# Altium project GEM_AFE_128.PrjPcb (part 4 of 4)
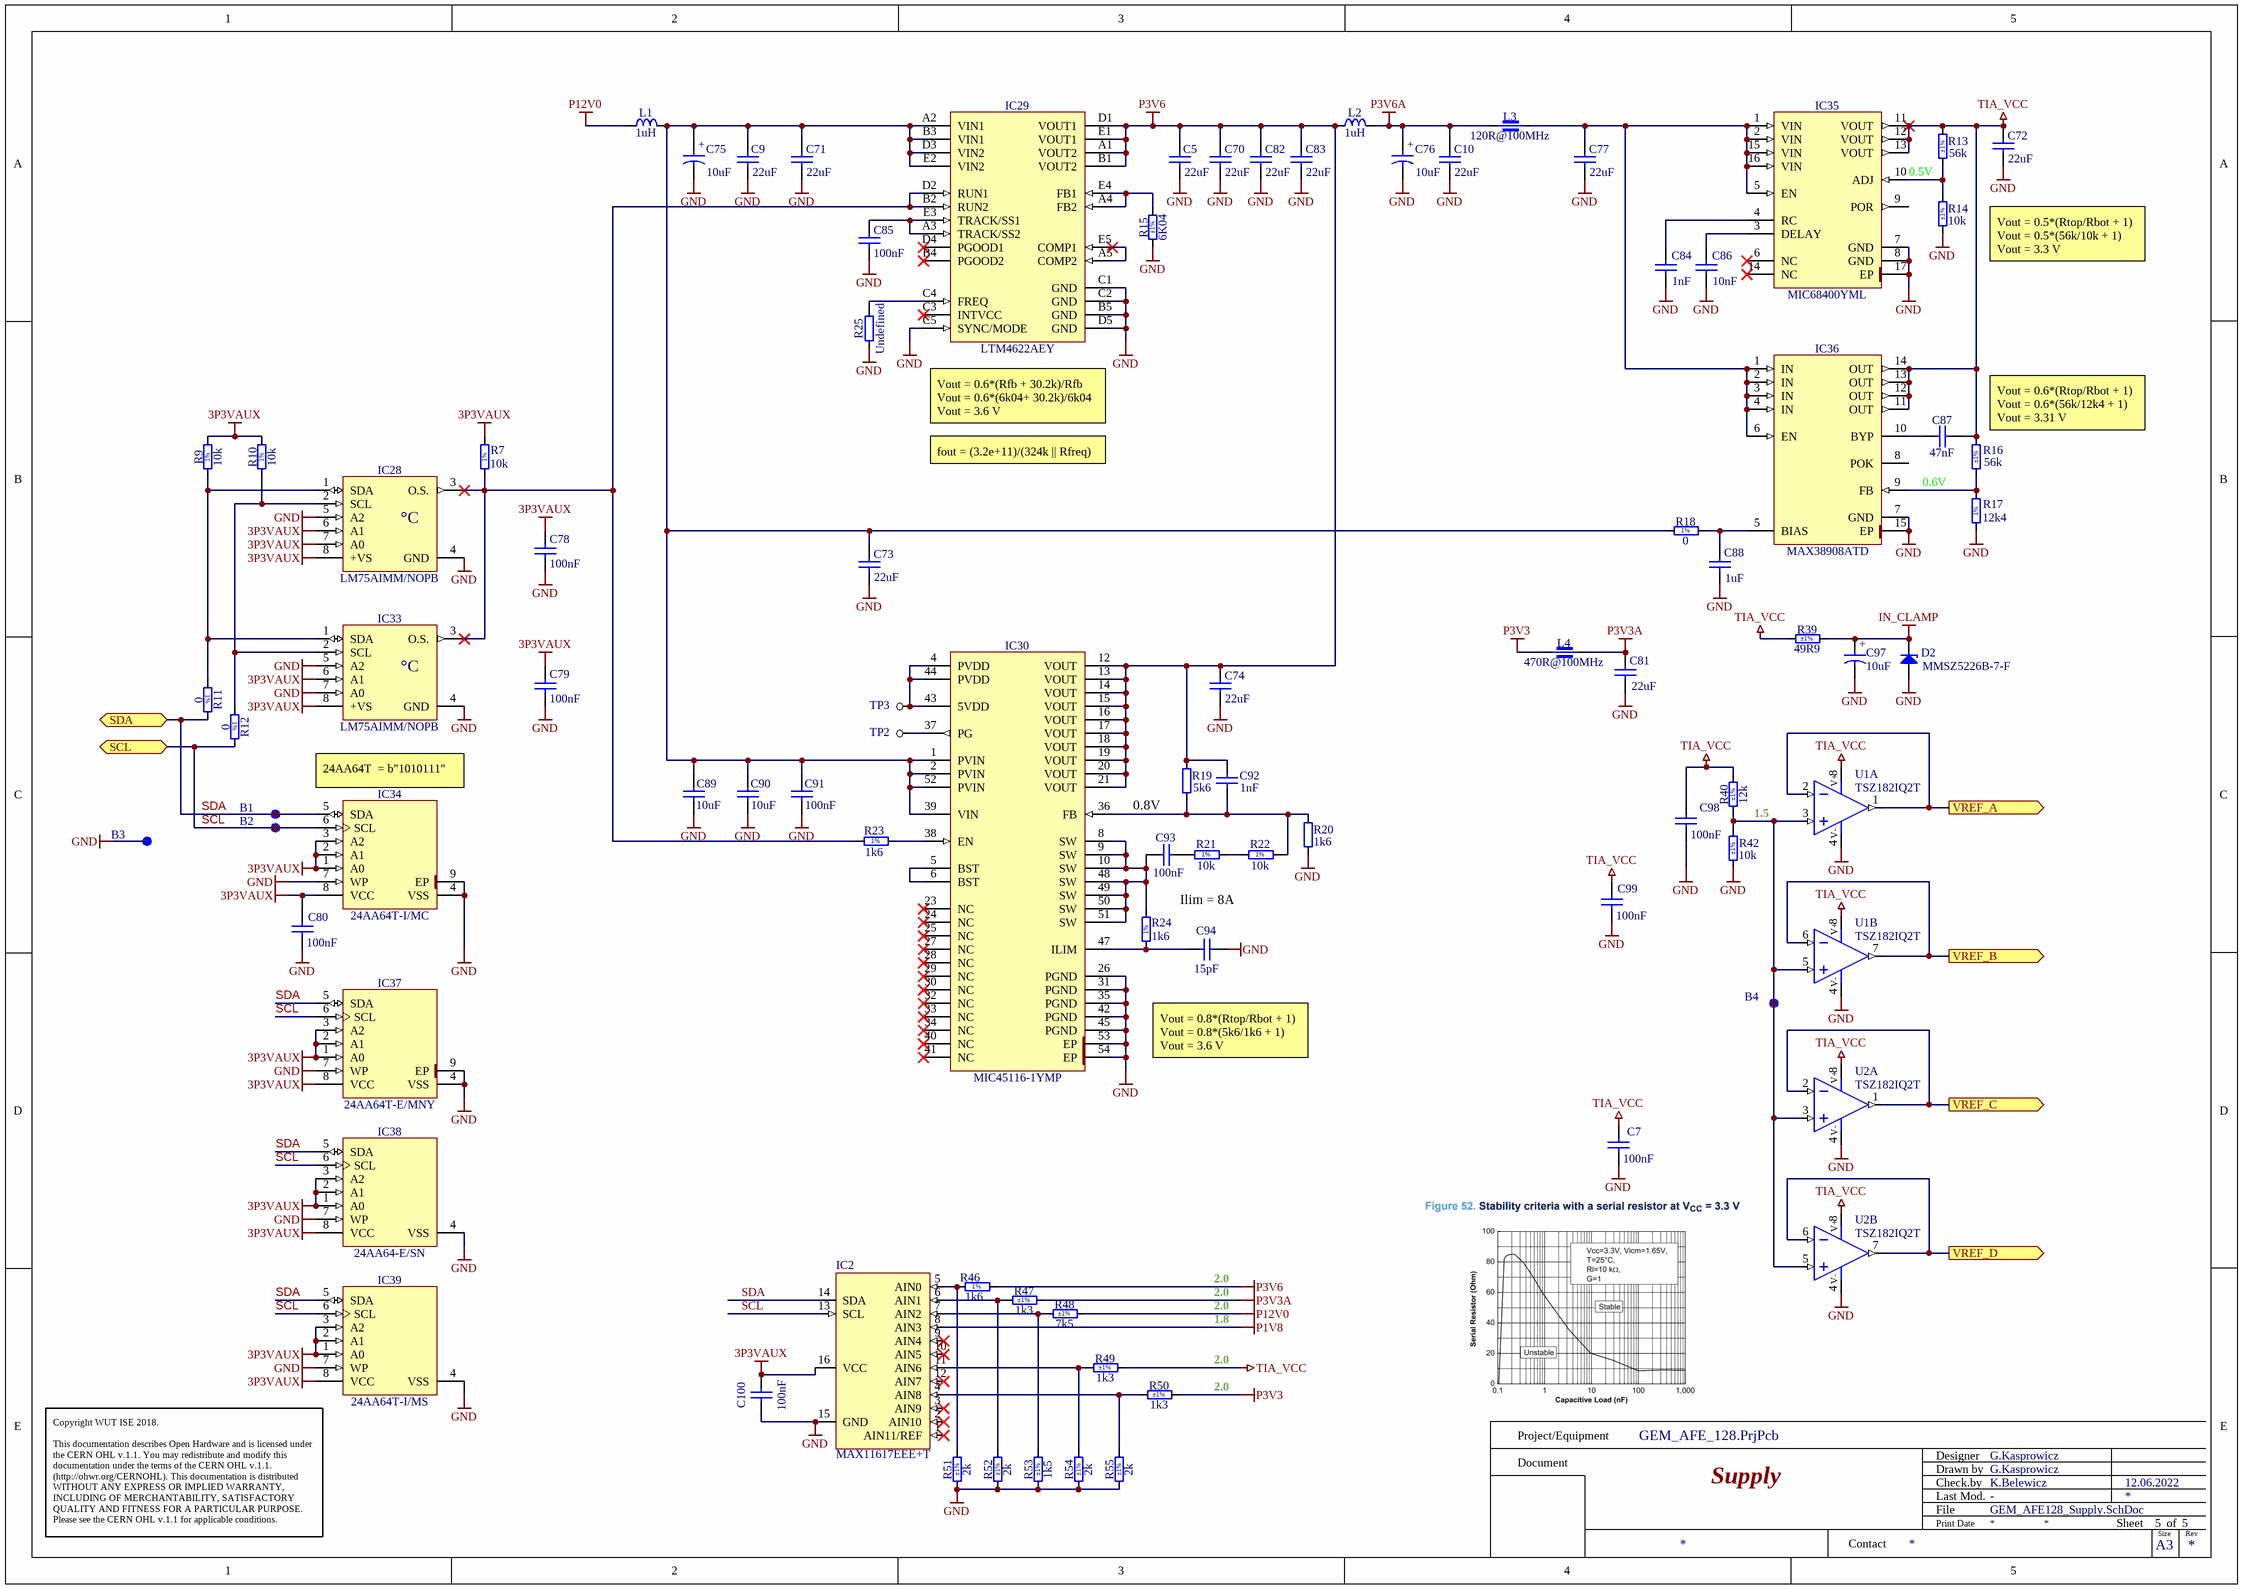
[diagram p5: GEM_AFE128_Supply.SchDoc]

## Nets that join several sheets
3P3VAUX: GEM_AFE_128 (J2.41), GEM_AFE128_Supply (29 pins)
GND: GEM_AFE_128 (102 pins), U_FE_channel0 (9 pins), U_FE_channel1 (9 pins), U_FE_channel2 (9 pins), U_FE_channel3 (9 pins), U_FE_channel4 (9 pins), U_FE_channel5 (9 pins), U_FE_channel6 (9 pins), U_FE_channel7 (9 pins), U_FE_channel8 (9 pins), U_FE_channel9 (9 pins), U_FE_channel10 (9 pins), U_FE_channel11 (9 pins), U_FE_channel12 (9 pins), U_FE_channel13 (9 pins), U_FE_channel14 (9 pins), U_FE_channel15 (9 pins), U_FE_channel16 (9 pins), U_FE_channel17 (9 pins), U_FE_channel18 (9 pins), U_FE_channel19 (9 pins), U_FE_channel20 (9 pins), U_FE_channel21 (9 pins), U_FE_channel22 (9 pins), U_FE_channel23 (9 pins), U_FE_channel24 (9 pins), U_FE_channel25 (9 pins), U_FE_channel26 (9 pins), U_FE_channel27 (9 pins), U_FE_channel28 (9 pins), U_FE_channel29 (9 pins), U_FE_channel30 (9 pins), U_FE_channel31 (9 pins), U_FE_channel32 (9 pins), U_FE_channel33 (9 pins), U_FE_channel34 (9 pins), U_FE_channel35 (9 pins), U_FE_channel36 (9 pins), U_FE_channel37 (9 pins), U_FE_channel38 (9 pins), U_FE_channel39 (9 pins), U_FE_channel40 (9 pins), U_FE_channel41 (9 pins), U_FE_channel42 (9 pins), U_FE_channel43 (9 pins), U_FE_channel44 (9 pins), U_FE_channel45 (9 pins), U_FE_channel46 (9 pins), U_FE_channel47 (9 pins), U_FE_channel48 (9 pins), U_FE_channel49 (9 pins), U_FE_channel50 (9 pins), U_FE_channel51 (9 pins), U_FE_channel52 (9 pins), U_FE_channel53 (9 pins), U_FE_channel54 (9 pins), U_FE_channel55 (9 pins), U_FE_channel56 (9 pins), U_FE_channel57 (9 pins), U_FE_channel58 (9 pins), U_FE_channel59 (9 pins), U_FE_channel60 (9 pins), U_FE_channel61 (9 pins), U_FE_channel62 (9 pins), U_FE_channel63 (9 pins), U_FE_channel64 (9 pins), U_FE_channel65 (9 pins), U_FE_channel66 (9 pins), U_FE_channel67 (9 pins), U_FE_channel68 (9 pins), U_FE_channel69 (9 pins), U_FE_channel70 (9 pins), U_FE_channel71 (9 pins), U_FE_channel72 (9 pins), U_FE_channel73 (9 pins), U_FE_channel74 (9 pins), U_FE_channel75 (9 pins), U_FE_channel76 (9 pins), U_FE_channel77 (9 pins), U_FE_channel78 (9 pins), U_FE_channel79 (9 pins), U_FE_channel80 (9 pins), U_FE_channel81 (9 pins), U_FE_channel82 (9 pins), U_FE_channel83 (9 pins), U_FE_channel84 (9 pins), U_FE_channel85 (9 pins), U_FE_channel86 (9 pins), U_FE_channel87 (9 pins), U_FE_channel88 (9 pins), U_FE_channel89 (9 pins), U_FE_channel90 (9 pins), U_FE_channel91 (9 pins), U_FE_channel92 (9 pins), U_FE_channel93 (9 pins), U_FE_channel94 (9 pins), U_FE_channel95 (9 pins), U_FE_channel96 (9 pins), U_FE_channel97 (9 pins), U_FE_channel98 (9 pins), U_FE_channel99 (9 pins), U_FE_channel100 (9 pins), U_FE_channel101 (9 pins), U_FE_channel102 (9 pins), U_FE_channel103 (9 pins), U_FE_channel104 (9 pins), U_FE_channel105 (9 pins), U_FE_channel106 (9 pins), U_FE_channel107 (9 pins), U_FE_channel108 (9 pins), U_FE_channel109 (9 pins), U_FE_channel110 (9 pins), U_FE_channel111 (9 pins), U_FE_channel112 (9 pins), U_FE_channel113 (9 pins), U_FE_channel114 (9 pins), U_FE_channel115 (9 pins), U_FE_channel116 (9 pins), U_FE_channel117 (9 pins), U_FE_channel118 (9 pins), U_FE_channel119 (9 pins), U_FE_channel120 (9 pins), U_FE_channel121 (9 pins), U_FE_channel122 (9 pins), U_FE_channel123 (9 pins), U_FE_channel124 (9 pins), U_FE_channel125 (9 pins), U_FE_channel126 (9 pins), U_FE_channel127 (9 pins), DAC (75 pins), CAL_logics (50 pins), GEM_AFE128_Supply (78 pins)
IN_CLAMP: U_FE_channel0 (C3A.2 D1A.5), U_FE_channel1 (C3B.2 D1B.5), U_FE_channel2 (C3C.2 D1C.5), U_FE_channel3 (C3D.2 D1D.5), U_FE_channel4 (C3E.2 D1E.5), U_FE_channel5 (C3F.2 D1F.5), U_FE_channel6 (C3G.2 D1G.5), U_FE_channel7 (C3H.2 D1H.5), U_FE_channel8 (C3I.2 D1I.5), U_FE_channel9 (C3J.2 D1J.5), U_FE_channel10 (C3K.2 D1K.5), U_FE_channel11 (C3L.2 D1L.5), U_FE_channel12 (C3M.2 D1M.5), U_FE_channel13 (C3N.2 D1N.5), U_FE_channel14 (C3O.2 D1O.5), U_FE_channel15 (C3P.2 D1P.5), U_FE_channel16 (C3Q.2 D1Q.5), U_FE_channel17 (C3R.2 D1R.5), U_FE_channel18 (C3S.2 D1S.5), U_FE_channel19 (C3T.2 D1T.5), U_FE_channel20 (C3U.2 D1U.5), U_FE_channel21 (C3V.2 D1V.5), U_FE_channel22 (C3W.2 D1W.5), U_FE_channel23 (C3X.2 D1X.5), U_FE_channel24 (C3Y.2 D1Y.5), U_FE_channel25 (C3Z.2 D1Z.5), U_FE_channel26 (C327.2 D127.5), U_FE_channel27 (C328.2 D128.5), U_FE_channel28 (C329.2 D129.5), U_FE_channel29 (C330.2 D130.5), U_FE_channel30 (C331.2 D131.5), U_FE_channel31 (C332.2 D132.5), U_FE_channel32 (C333.2 D133.5), U_FE_channel33 (C334.2 D134.5), U_FE_channel34 (C335.2 D135.5), U_FE_channel35 (C336.2 D136.5), U_FE_channel36 (C337.2 D137.5), U_FE_channel37 (C338.2 D138.5), U_FE_channel38 (C339.2 D139.5), U_FE_channel39 (C340.2 D140.5), U_FE_channel40 (C341.2 D141.5), U_FE_channel41 (C342.2 D142.5), U_FE_channel42 (C343.2 D143.5), U_FE_channel43 (C344.2 D144.5), U_FE_channel44 (C345.2 D145.5), U_FE_channel45 (C346.2 D146.5), U_FE_channel46 (C347.2 D147.5), U_FE_channel47 (C348.2 D148.5), U_FE_channel48 (C349.2 D149.5), U_FE_channel49 (C350.2 D150.5), U_FE_channel50 (C351.2 D151.5), U_FE_channel51 (C352.2 D152.5), U_FE_channel52 (C353.2 D153.5), U_FE_channel53 (C354.2 D154.5), U_FE_channel54 (C355.2 D155.5), U_FE_channel55 (C356.2 D156.5), U_FE_channel56 (C357.2 D157.5), U_FE_channel57 (C358.2 D158.5), U_FE_channel58 (C359.2 D159.5), U_FE_channel59 (C360.2 D160.5), U_FE_channel60 (C361.2 D161.5), U_FE_channel61 (C362.2 D162.5), U_FE_channel62 (C363.2 D163.5), U_FE_channel63 (C364.2 D164.5), U_FE_channel64 (C365.2 D165.5), U_FE_channel65 (C366.2 D166.5), U_FE_channel66 (C367.2 D167.5), U_FE_channel67 (C368.2 D168.5), U_FE_channel68 (C369.2 D169.5), U_FE_channel69 (C370.2 D170.5), U_FE_channel70 (C371.2 D171.5), U_FE_channel71 (C372.2 D172.5), U_FE_channel72 (C373.2 D173.5), U_FE_channel73 (C374.2 D174.5), U_FE_channel74 (C375.2 D175.5), U_FE_channel75 (C376.2 D176.5), U_FE_channel76 (C377.2 D177.5), U_FE_channel77 (C378.2 D178.5), U_FE_channel78 (C379.2 D179.5), U_FE_channel79 (C380.2 D180.5), U_FE_channel80 (C381.2 D181.5), U_FE_channel81 (C382.2 D182.5), U_FE_channel82 (C383.2 D183.5), U_FE_channel83 (C384.2 D184.5), U_FE_channel84 (C385.2 D185.5), U_FE_channel85 (C386.2 D186.5), U_FE_channel86 (C387.2 D187.5), U_FE_channel87 (C388.2 D188.5), U_FE_channel88 (C389.2 D189.5), U_FE_channel89 (C390.2 D190.5), U_FE_channel90 (C391.2 D191.5), U_FE_channel91 (C392.2 D192.5), U_FE_channel92 (C393.2 D193.5), U_FE_channel93 (C394.2 D194.5), U_FE_channel94 (C395.2 D195.5), U_FE_channel95 (C396.2 D196.5), U_FE_channel96 (C397.2 D197.5), U_FE_channel97 (C398.2 D198.5), U_FE_channel98 (C399.2 D199.5), U_FE_channel99 (C3100.2 D1100.5), U_FE_channel100 (C3101.2 D1101.5), U_FE_channel101 (C3102.2 D1102.5), U_FE_channel102 (C3103.2 D1103.5), U_FE_channel103 (C3104.2 D1104.5), U_FE_channel104 (C3105.2 D1105.5), U_FE_channel105 (C3106.2 D1106.5), U_FE_channel106 (C3107.2 D1107.5), U_FE_channel107 (C3108.2 D1108.5), U_FE_channel108 (C3109.2 D1109.5), U_FE_channel109 (C3110.2 D1110.5), U_FE_channel110 (C3111.2 D1111.5), U_FE_channel111 (C3112.2 D1112.5), U_FE_channel112 (C3113.2 D1113.5), U_FE_channel113 (C3114.2 D1114.5), U_FE_channel114 (C3115.2 D1115.5), U_FE_channel115 (C3116.2 D1116.5), U_FE_channel116 (C3117.2 D1117.5), U_FE_channel117 (C3118.2 D1118.5), U_FE_channel118 (C3119.2 D1119.5), U_FE_channel119 (C3120.2 D1120.5), U_FE_channel120 (C3121.2 D1121.5), U_FE_channel121 (C3122.2 D1122.5), U_FE_channel122 (C3123.2 D1123.5), U_FE_channel123 (C3124.2 D1124.5), U_FE_channel124 (C3125.2 D1125.5), U_FE_channel125 (C3126.2 D1126.5), U_FE_channel126 (C3127.2 D1127.5), U_FE_channel127 (C3128.2 D1128.5), GEM_AFE128_Supply (C97.1 D2.1 R39.2)
P1V8: GEM_AFE_128 (7 pins), DAC (27 pins), GEM_AFE128_Supply (IC2.8)
P3V3: GEM_AFE_128 (17 pins), GEM_AFE128_Supply (L4.1 R50.2)
P3V3A: DAC (24 pins), CAL_logics (50 pins), GEM_AFE128_Supply (C81.2 L4.2 R47.2)
P12V0: GEM_AFE_128 (5 pins), GEM_AFE128_Supply (L1.1 R48.2)
TIA_VCC: GEM_AFE_128 (LD3.2), U_FE_channel0 (C6A.2 IC1A.7 IC1A.8), U_FE_channel1 (C6B.2 IC1B.7 IC1B.8), U_FE_channel2 (C6C.2 IC1C.7 IC1C.8), U_FE_channel3 (C6D.2 IC1D.7 IC1D.8), U_FE_channel4 (C6E.2 IC1E.7 IC1E.8), U_FE_channel5 (C6F.2 IC1F.7 IC1F.8), U_FE_channel6 (C6G.2 IC1G.7 IC1G.8), U_FE_channel7 (C6H.2 IC1H.7 IC1H.8), U_FE_channel8 (C6I.2 IC1I.7 IC1I.8), U_FE_channel9 (C6J.2 IC1J.7 IC1J.8), U_FE_channel10 (C6K.2 IC1K.7 IC1K.8), U_FE_channel11 (C6L.2 IC1L.7 IC1L.8), U_FE_channel12 (C6M.2 IC1M.7 IC1M.8), U_FE_channel13 (C6N.2 IC1N.7 IC1N.8), U_FE_channel14 (C6O.2 IC1O.7 IC1O.8), U_FE_channel15 (C6P.2 IC1P.7 IC1P.8), U_FE_channel16 (C6Q.2 IC1Q.7 IC1Q.8), U_FE_channel17 (C6R.2 IC1R.7 IC1R.8), U_FE_channel18 (C6S.2 IC1S.7 IC1S.8), U_FE_channel19 (C6T.2 IC1T.7 IC1T.8), U_FE_channel20 (C6U.2 IC1U.7 IC1U.8), U_FE_channel21 (C6V.2 IC1V.7 IC1V.8), U_FE_channel22 (C6W.2 IC1W.7 IC1W.8), U_FE_channel23 (C6X.2 IC1X.7 IC1X.8), U_FE_channel24 (C6Y.2 IC1Y.7 IC1Y.8), U_FE_channel25 (C6Z.2 IC1Z.7 IC1Z.8), U_FE_channel26 (C627.2 IC127.7 IC127.8), U_FE_channel27 (C628.2 IC128.7 IC128.8), U_FE_channel28 (C629.2 IC129.7 IC129.8), U_FE_channel29 (C630.2 IC130.7 IC130.8), U_FE_channel30 (C631.2 IC131.7 IC131.8), U_FE_channel31 (C632.2 IC132.7 IC132.8), U_FE_channel32 (C633.2 IC133.7 IC133.8), U_FE_channel33 (C634.2 IC134.7 IC134.8), U_FE_channel34 (C635.2 IC135.7 IC135.8), U_FE_channel35 (C636.2 IC136.7 IC136.8), U_FE_channel36 (C637.2 IC137.7 IC137.8), U_FE_channel37 (C638.2 IC138.7 IC138.8), U_FE_channel38 (C639.2 IC139.7 IC139.8), U_FE_channel39 (C640.2 IC140.7 IC140.8), U_FE_channel40 (C641.2 IC141.7 IC141.8), U_FE_channel41 (C642.2 IC142.7 IC142.8), U_FE_channel42 (C643.2 IC143.7 IC143.8), U_FE_channel43 (C644.2 IC144.7 IC144.8), U_FE_channel44 (C645.2 IC145.7 IC145.8), U_FE_channel45 (C646.2 IC146.7 IC146.8), U_FE_channel46 (C647.2 IC147.7 IC147.8), U_FE_channel47 (C648.2 IC148.7 IC148.8), U_FE_channel48 (C649.2 IC149.7 IC149.8), U_FE_channel49 (C650.2 IC150.7 IC150.8), U_FE_channel50 (C651.2 IC151.7 IC151.8), U_FE_channel51 (C652.2 IC152.7 IC152.8), U_FE_channel52 (C653.2 IC153.7 IC153.8), U_FE_channel53 (C654.2 IC154.7 IC154.8), U_FE_channel54 (C655.2 IC155.7 IC155.8), U_FE_channel55 (C656.2 IC156.7 IC156.8), U_FE_channel56 (C657.2 IC157.7 IC157.8), U_FE_channel57 (C658.2 IC158.7 IC158.8), U_FE_channel58 (C659.2 IC159.7 IC159.8), U_FE_channel59 (C660.2 IC160.7 IC160.8), U_FE_channel60 (C661.2 IC161.7 IC161.8), U_FE_channel61 (C662.2 IC162.7 IC162.8), U_FE_channel62 (C663.2 IC163.7 IC163.8), U_FE_channel63 (C664.2 IC164.7 IC164.8), U_FE_channel64 (C665.2 IC165.7 IC165.8), U_FE_channel65 (C666.2 IC166.7 IC166.8), U_FE_channel66 (C667.2 IC167.7 IC167.8), U_FE_channel67 (C668.2 IC168.7 IC168.8), U_FE_channel68 (C669.2 IC169.7 IC169.8), U_FE_channel69 (C670.2 IC170.7 IC170.8), U_FE_channel70 (C671.2 IC171.7 IC171.8), U_FE_channel71 (C672.2 IC172.7 IC172.8), U_FE_channel72 (C673.2 IC173.7 IC173.8), U_FE_channel73 (C674.2 IC174.7 IC174.8), U_FE_channel74 (C675.2 IC175.7 IC175.8), U_FE_channel75 (C676.2 IC176.7 IC176.8), U_FE_channel76 (C677.2 IC177.7 IC177.8), U_FE_channel77 (C678.2 IC178.7 IC178.8), U_FE_channel78 (C679.2 IC179.7 IC179.8), U_FE_channel79 (C680.2 IC180.7 IC180.8), U_FE_channel80 (C681.2 IC181.7 IC181.8), U_FE_channel81 (C682.2 IC182.7 IC182.8), U_FE_channel82 (C683.2 IC183.7 IC183.8), U_FE_channel83 (C684.2 IC184.7 IC184.8), U_FE_channel84 (C685.2 IC185.7 IC185.8), U_FE_channel85 (C686.2 IC186.7 IC186.8), U_FE_channel86 (C687.2 IC187.7 IC187.8), U_FE_channel87 (C688.2 IC188.7 IC188.8), U_FE_channel88 (C689.2 IC189.7 IC189.8), U_FE_channel89 (C690.2 IC190.7 IC190.8), U_FE_channel90 (C691.2 IC191.7 IC191.8), U_FE_channel91 (C692.2 IC192.7 IC192.8), U_FE_channel92 (C693.2 IC193.7 IC193.8), U_FE_channel93 (C694.2 IC194.7 IC194.8), U_FE_channel94 (C695.2 IC195.7 IC195.8), U_FE_channel95 (C696.2 IC196.7 IC196.8), U_FE_channel96 (C697.2 IC197.7 IC197.8), U_FE_channel97 (C698.2 IC198.7 IC198.8), U_FE_channel98 (C699.2 IC199.7 IC199.8), U_FE_channel99 (C6100.2 IC1100.7 IC1100.8), U_FE_channel100 (C6101.2 IC1101.7 IC1101.8), U_FE_channel101 (C6102.2 IC1102.7 IC1102.8), U_FE_channel102 (C6103.2 IC1103.7 IC1103.8), U_FE_channel103 (C6104.2 IC1104.7 IC1104.8), U_FE_channel104 (C6105.2 IC1105.7 IC1105.8), U_FE_channel105 (C6106.2 IC1106.7 IC1106.8), U_FE_channel106 (C6107.2 IC1107.7 IC1107.8), U_FE_channel107 (C6108.2 IC1108.7 IC1108.8), U_FE_channel108 (C6109.2 IC1109.7 IC1109.8), U_FE_channel109 (C6110.2 IC1110.7 IC1110.8), U_FE_channel110 (C6111.2 IC1111.7 IC1111.8), U_FE_channel111 (C6112.2 IC1112.7 IC1112.8), U_FE_channel112 (C6113.2 IC1113.7 IC1113.8), U_FE_channel113 (C6114.2 IC1114.7 IC1114.8), U_FE_channel114 (C6115.2 IC1115.7 IC1115.8), U_FE_channel115 (C6116.2 IC1116.7 IC1116.8), U_FE_channel116 (C6117.2 IC1117.7 IC1117.8), U_FE_channel117 (C6118.2 IC1118.7 IC1118.8), U_FE_channel118 (C6119.2 IC1119.7 IC1119.8), U_FE_channel119 (C6120.2 IC1120.7 IC1120.8), U_FE_channel120 (C6121.2 IC1121.7 IC1121.8), U_FE_channel121 (C6122.2 IC1122.7 IC1122.8), U_FE_channel122 (C6123.2 IC1123.7 IC1123.8), U_FE_channel123 (C6124.2 IC1124.7 IC1124.8), U_FE_channel124 (C6125.2 IC1125.7 IC1125.8), U_FE_channel125 (C6126.2 IC1126.7 IC1126.8), U_FE_channel126 (C6127.2 IC1127.7 IC1127.8), U_FE_channel127 (C6128.2 IC1128.7 IC1128.8), GEM_AFE128_Supply (19 pins)
CAL_IN0: U_FE_channel0 (C1A.2 R1A.2), CAL_logics (IC13.15)
CAL_IN1: U_FE_channel1 (C1B.2 R1B.2), CAL_logics (IC13.1)
CAL_IN2: U_FE_channel2 (C1C.2 R1C.2), CAL_logics (IC13.2)
CAL_IN3: U_FE_channel3 (C1D.2 R1D.2), CAL_logics (IC13.3)
CAL_IN4: U_FE_channel4 (C1E.2 R1E.2), CAL_logics (IC13.4)
CAL_IN5: U_FE_channel5 (C1F.2 R1F.2), CAL_logics (IC13.5)
CAL_IN6: U_FE_channel6 (C1G.2 R1G.2), CAL_logics (IC13.6)
CAL_IN7: U_FE_channel7 (C1H.2 R1H.2), CAL_logics (IC13.7)
CAL_IN8: U_FE_channel8 (C1I.2 R1I.2), CAL_logics (IC15.15)
CAL_IN9: U_FE_channel9 (C1J.2 R1J.2), CAL_logics (IC15.1)
CAL_IN10: U_FE_channel10 (C1K.2 R1K.2), CAL_logics (IC15.2)
CAL_IN11: U_FE_channel11 (C1L.2 R1L.2), CAL_logics (IC15.3)
CAL_IN12: U_FE_channel12 (C1M.2 R1M.2), CAL_logics (IC15.4)
CAL_IN13: U_FE_channel13 (C1N.2 R1N.2), CAL_logics (IC15.5)
CAL_IN14: U_FE_channel14 (C1O.2 R1O.2), CAL_logics (IC15.6)
CAL_IN15: U_FE_channel15 (C1P.2 R1P.2), CAL_logics (IC15.7)
CAL_IN16: U_FE_channel16 (C1Q.2 R1Q.2), CAL_logics (IC17.15)
CAL_IN17: U_FE_channel17 (C1R.2 R1R.2), CAL_logics (IC17.1)
CAL_IN18: U_FE_channel18 (C1S.2 R1S.2), CAL_logics (IC17.2)
CAL_IN19: U_FE_channel19 (C1T.2 R1T.2), CAL_logics (IC17.3)
CAL_IN20: U_FE_channel20 (C1U.2 R1U.2), CAL_logics (IC17.4)
CAL_IN21: U_FE_channel21 (C1V.2 R1V.2), CAL_logics (IC17.5)
CAL_IN22: U_FE_channel22 (C1W.2 R1W.2), CAL_logics (IC17.6)
CAL_IN23: U_FE_channel23 (C1X.2 R1X.2), CAL_logics (IC17.7)
CAL_IN24: U_FE_channel24 (C1Y.2 R1Y.2), CAL_logics (IC19.15)
CAL_IN25: U_FE_channel25 (C1Z.2 R1Z.2), CAL_logics (IC19.1)
CAL_IN26: U_FE_channel26 (C127.2 R127.2), CAL_logics (IC19.2)
CAL_IN27: U_FE_channel27 (C128.2 R128.2), CAL_logics (IC19.3)
CAL_IN28: U_FE_channel28 (C129.2 R129.2), CAL_logics (IC19.4)
CAL_IN29: U_FE_channel29 (C130.2 R130.2), CAL_logics (IC19.5)
CAL_IN30: U_FE_channel30 (C131.2 R131.2), CAL_logics (IC19.6)
CAL_IN31: U_FE_channel31 (C132.2 R132.2), CAL_logics (IC19.7)
CAL_IN32: U_FE_channel32 (C133.2 R133.2), CAL_logics (IC21.15)
CAL_IN33: U_FE_channel33 (C134.2 R134.2), CAL_logics (IC21.1)
CAL_IN34: U_FE_channel34 (C135.2 R135.2), CAL_logics (IC21.2)
CAL_IN35: U_FE_channel35 (C136.2 R136.2), CAL_logics (IC21.3)
CAL_IN36: U_FE_channel36 (C137.2 R137.2), CAL_logics (IC21.4)
CAL_IN37: U_FE_channel37 (C138.2 R138.2), CAL_logics (IC21.5)
CAL_IN38: U_FE_channel38 (C139.2 R139.2), CAL_logics (IC21.6)
CAL_IN39: U_FE_channel39 (C140.2 R140.2), CAL_logics (IC21.7)
CAL_IN40: U_FE_channel40 (C141.2 R141.2), CAL_logics (IC23.15)
CAL_IN41: U_FE_channel41 (C142.2 R142.2), CAL_logics (IC23.1)
CAL_IN42: U_FE_channel42 (C143.2 R143.2), CAL_logics (IC23.2)
CAL_IN43: U_FE_channel43 (C144.2 R144.2), CAL_logics (IC23.3)
CAL_IN44: U_FE_channel44 (C145.2 R145.2), CAL_logics (IC23.4)
CAL_IN45: U_FE_channel45 (C146.2 R146.2), CAL_logics (IC23.5)
CAL_IN46: U_FE_channel46 (C147.2 R147.2), CAL_logics (IC23.6)
CAL_IN47: U_FE_channel47 (C148.2 R148.2), CAL_logics (IC23.7)
CAL_IN48: U_FE_channel48 (C149.2 R149.2), CAL_logics (IC25.15)
CAL_IN49: U_FE_channel49 (C150.2 R150.2), CAL_logics (IC25.1)
CAL_IN50: U_FE_channel50 (C151.2 R151.2), CAL_logics (IC25.2)
CAL_IN51: U_FE_channel51 (C152.2 R152.2), CAL_logics (IC25.3)
CAL_IN52: U_FE_channel52 (C153.2 R153.2), CAL_logics (IC25.4)
CAL_IN53: U_FE_channel53 (C154.2 R154.2), CAL_logics (IC25.5)
CAL_IN54: U_FE_channel54 (C155.2 R155.2), CAL_logics (IC25.6)
CAL_IN55: U_FE_channel55 (C156.2 R156.2), CAL_logics (IC25.7)
CAL_IN56: U_FE_channel56 (C157.2 R157.2), CAL_logics (IC27.15)
CAL_IN57: U_FE_channel57 (C158.2 R158.2), CAL_logics (IC27.1)
CAL_IN58: U_FE_channel58 (C159.2 R159.2), CAL_logics (IC27.2)
CAL_IN59: U_FE_channel59 (C160.2 R160.2), CAL_logics (IC27.3)
CAL_IN60: U_FE_channel60 (C161.2 R161.2), CAL_logics (IC27.4)
CAL_IN61: U_FE_channel61 (C162.2 R162.2), CAL_logics (IC27.5)
CAL_IN62: U_FE_channel62 (C163.2 R163.2), CAL_logics (IC27.6)
CAL_IN63: U_FE_channel63 (C164.2 R164.2), CAL_logics (IC27.7)
CAL_IN64: U_FE_channel64 (C165.2 R165.2), CAL_logics (IC12.15)
CAL_IN65: U_FE_channel65 (C166.2 R166.2), CAL_logics (IC12.1)
CAL_IN66: U_FE_channel66 (C167.2 R167.2), CAL_logics (IC12.2)
CAL_IN67: U_FE_channel67 (C168.2 R168.2), CAL_logics (IC12.3)
CAL_IN68: U_FE_channel68 (C169.2 R169.2), CAL_logics (IC12.4)
CAL_IN69: U_FE_channel69 (C170.2 R170.2), CAL_logics (IC12.5)
CAL_IN70: U_FE_channel70 (C171.2 R171.2), CAL_logics (IC12.6)
CAL_IN71: U_FE_channel71 (C172.2 R172.2), CAL_logics (IC12.7)
CAL_IN72: U_FE_channel72 (C173.2 R173.2), CAL_logics (IC14.15)
CAL_IN73: U_FE_channel73 (C174.2 R174.2), CAL_logics (IC14.1)
CAL_IN74: U_FE_channel74 (C175.2 R175.2), CAL_logics (IC14.2)
CAL_IN75: U_FE_channel75 (C176.2 R176.2), CAL_logics (IC14.3)
CAL_IN76: U_FE_channel76 (C177.2 R177.2), CAL_logics (IC14.4)
CAL_IN77: U_FE_channel77 (C178.2 R178.2), CAL_logics (IC14.5)
CAL_IN78: U_FE_channel78 (C179.2 R179.2), CAL_logics (IC14.6)
CAL_IN79: U_FE_channel79 (C180.2 R180.2), CAL_logics (IC14.7)
CAL_IN80: U_FE_channel80 (C181.2 R181.2), CAL_logics (IC16.15)
CAL_IN81: U_FE_channel81 (C182.2 R182.2), CAL_logics (IC16.1)
CAL_IN82: U_FE_channel82 (C183.2 R183.2), CAL_logics (IC16.2)
CAL_IN83: U_FE_channel83 (C184.2 R184.2), CAL_logics (IC16.3)
CAL_IN84: U_FE_channel84 (C185.2 R185.2), CAL_logics (IC16.4)
CAL_IN85: U_FE_channel85 (C186.2 R186.2), CAL_logics (IC16.5)
CAL_IN86: U_FE_channel86 (C187.2 R187.2), CAL_logics (IC16.6)
CAL_IN87: U_FE_channel87 (C188.2 R188.2), CAL_logics (IC16.7)
CAL_IN88: U_FE_channel88 (C189.2 R189.2), CAL_logics (IC18.15)
CAL_IN89: U_FE_channel89 (C190.2 R190.2), CAL_logics (IC18.1)
CAL_IN90: U_FE_channel90 (C191.2 R191.2), CAL_logics (IC18.2)
CAL_IN91: U_FE_channel91 (C192.2 R192.2), CAL_logics (IC18.3)
CAL_IN92: U_FE_channel92 (C193.2 R193.2), CAL_logics (IC18.4)
CAL_IN93: U_FE_channel93 (C194.2 R194.2), CAL_logics (IC18.5)
CAL_IN94: U_FE_channel94 (C195.2 R195.2), CAL_logics (IC18.6)
CAL_IN95: U_FE_channel95 (C196.2 R196.2), CAL_logics (IC18.7)
CAL_IN96: U_FE_channel96 (C197.2 R197.2), CAL_logics (IC20.15)
CAL_IN97: U_FE_channel97 (C198.2 R198.2), CAL_logics (IC20.1)
CAL_IN98: U_FE_channel98 (C199.2 R199.2), CAL_logics (IC20.2)
CAL_IN99: U_FE_channel99 (C1100.2 R1100.2), CAL_logics (IC20.3)
CAL_IN100: U_FE_channel100 (C1101.2 R1101.2), CAL_logics (IC20.4)
CAL_IN101: U_FE_channel101 (C1102.2 R1102.2), CAL_logics (IC20.5)
CAL_IN102: U_FE_channel102 (C1103.2 R1103.2), CAL_logics (IC20.6)
CAL_IN103: U_FE_channel103 (C1104.2 R1104.2), CAL_logics (IC20.7)
CAL_IN104: U_FE_channel104 (C1105.2 R1105.2), CAL_logics (IC22.15)
CAL_IN105: U_FE_channel105 (C1106.2 R1106.2), CAL_logics (IC22.1)
CAL_IN106: U_FE_channel106 (C1107.2 R1107.2), CAL_logics (IC22.2)
CAL_IN107: U_FE_channel107 (C1108.2 R1108.2), CAL_logics (IC22.3)
CAL_IN108: U_FE_channel108 (C1109.2 R1109.2), CAL_logics (IC22.4)
CAL_IN109: U_FE_channel109 (C1110.2 R1110.2), CAL_logics (IC22.5)
CAL_IN110: U_FE_channel110 (C1111.2 R1111.2), CAL_logics (IC22.6)
CAL_IN111: U_FE_channel111 (C1112.2 R1112.2), CAL_logics (IC22.7)
CAL_IN112: U_FE_channel112 (C1113.2 R1113.2), CAL_logics (IC24.15)
CAL_IN113: U_FE_channel113 (C1114.2 R1114.2), CAL_logics (IC24.1)
CAL_IN114: U_FE_channel114 (C1115.2 R1115.2), CAL_logics (IC24.2)
CAL_IN115: U_FE_channel115 (C1116.2 R1116.2), CAL_logics (IC24.3)
CAL_IN116: U_FE_channel116 (C1117.2 R1117.2), CAL_logics (IC24.4)
CAL_IN117: U_FE_channel117 (C1118.2 R1118.2), CAL_logics (IC24.5)
CAL_IN118: U_FE_channel118 (C1119.2 R1119.2), CAL_logics (IC24.6)
CAL_IN119: U_FE_channel119 (C1120.2 R1120.2), CAL_logics (IC24.7)
CAL_IN120: U_FE_channel120 (C1121.2 R1121.2), CAL_logics (IC26.15)
CAL_IN121: U_FE_channel121 (C1122.2 R1122.2), CAL_logics (IC26.1)
CAL_IN122: U_FE_channel122 (C1123.2 R1123.2), CAL_logics (IC26.2)
CAL_IN123: U_FE_channel123 (C1124.2 R1124.2), CAL_logics (IC26.3)
CAL_IN124: U_FE_channel124 (C1125.2 R1125.2), CAL_logics (IC26.4)
CAL_IN125: U_FE_channel125 (C1126.2 R1126.2), CAL_logics (IC26.5)
CAL_IN126: U_FE_channel126 (C1127.2 R1127.2), CAL_logics (IC26.6)
CAL_IN127: U_FE_channel127 (C1128.2 R1128.2), CAL_logics (IC26.7)
CAL_SRCLK: GEM_AFE_128 (R30.2), CAL_logics (16 pins)
CAL_SRDAT: GEM_AFE_128 (R29.1), CAL_logics (IC13.14)
CAL_SRDAT_OUT: GEM_AFE_128 (R28.1), CAL_logics (R3.2)
CS_A0: GEM_AFE_128 (R32.1), DAC (IC9.1)
CS_A1: GEM_AFE_128 (R33.1), DAC (IC9.2)
CS_A2: GEM_AFE_128 (R38.2), DAC (IC9.3)
CSn: GEM_AFE_128 (R34.2), DAC (IC9.4)
DAC_LDACn: GEM_AFE_128 (R27.1), DAC (8 pins)
DAC_RESETn: GEM_AFE_128 (R31.2 R56.1), DAC (8 pins)
DAC_SCLK: GEM_AFE_128 (R37.2), DAC (8 pins)
DAC_SDI: GEM_AFE_128 (R36.1), DAC (8 pins)
DAC_SDO: GEM_AFE_128 (R35.1), DAC (8 pins)
IN_P0: GEM_AFE_128 (J1.81), U_FE_channel0 (D1A.3 R4A.1 R8A.1)
IN_P1: GEM_AFE_128 (J1.90), U_FE_channel1 (D1B.3 R4B.1 R8B.1)
IN_P2: GEM_AFE_128 (J1.80), U_FE_channel2 (D1C.3 R4C.1 R8C.1)
IN_P3: GEM_AFE_128 (J1.91), U_FE_channel3 (D1D.3 R4D.1 R8D.1)
IN_P4: GEM_AFE_128 (J1.79), U_FE_channel4 (D1E.3 R4E.1 R8E.1)
IN_P5: GEM_AFE_128 (J1.78), U_FE_channel5 (D1F.3 R4F.1 R8F.1)
IN_P6: GEM_AFE_128 (J1.93), U_FE_channel6 (D1G.3 R4G.1 R8G.1)
IN_P7: GEM_AFE_128 (J1.77), U_FE_channel7 (D1H.3 R4H.1 R8H.1)
IN_P8: GEM_AFE_128 (J1.94), U_FE_channel8 (D1I.3 R4I.1 R8I.1)
IN_P9: GEM_AFE_128 (J1.76), U_FE_channel9 (D1J.3 R4J.1 R8J.1)
IN_P10: GEM_AFE_128 (J1.75), U_FE_channel10 (D1K.3 R4K.1 R8K.1)
IN_P11: GEM_AFE_128 (J1.96), U_FE_channel11 (D1L.3 R4L.1 R8L.1)
IN_P12: GEM_AFE_128 (J1.74), U_FE_channel12 (D1M.3 R4M.1 R8M.1)
IN_P13: GEM_AFE_128 (J1.97), U_FE_channel13 (D1N.3 R4N.1 R8N.1)
IN_P14: GEM_AFE_128 (J1.73), U_FE_channel14 (D1O.3 R4O.1 R8O.1)
IN_P15: GEM_AFE_128 (J1.72), U_FE_channel15 (D1P.3 R4P.1 R8P.1)
IN_P16: GEM_AFE_128 (J1.99), U_FE_channel16 (D1Q.3 R4Q.1 R8Q.1)
IN_P17: GEM_AFE_128 (J1.71), U_FE_channel17 (D1R.3 R4R.1 R8R.1)
IN_P18: GEM_AFE_128 (J1.100), U_FE_channel18 (D1S.3 R4S.1 R8S.1)
IN_P19: GEM_AFE_128 (J1.70), U_FE_channel19 (D1T.3 R4T.1 R8T.1)
IN_P20: GEM_AFE_128 (J1.69), U_FE_channel20 (D1U.3 R4U.1 R8U.1)
IN_P21: GEM_AFE_128 (J1.102), U_FE_channel21 (D1V.3 R4V.1 R8V.1)
IN_P22: GEM_AFE_128 (J1.68), U_FE_channel22 (D1W.3 R4W.1 R8W.1)
IN_P23: GEM_AFE_128 (J1.103), U_FE_channel23 (D1X.3 R4X.1 R8X.1)
IN_P24: GEM_AFE_128 (J1.67), U_FE_channel24 (D1Y.3 R4Y.1 R8Y.1)
IN_P25: GEM_AFE_128 (J1.66), U_FE_channel25 (D1Z.3 R4Z.1 R8Z.1)
IN_P26: GEM_AFE_128 (J1.105), U_FE_channel26 (D127.3 R427.1 R827.1)
IN_P27: GEM_AFE_128 (J1.65), U_FE_channel27 (D128.3 R428.1 R828.1)
IN_P28: GEM_AFE_128 (J1.106), U_FE_channel28 (D129.3 R429.1 R829.1)
IN_P29: GEM_AFE_128 (J1.64), U_FE_channel29 (D130.3 R430.1 R830.1)
IN_P30: GEM_AFE_128 (J1.63), U_FE_channel30 (D131.3 R431.1 R831.1)
IN_P31: GEM_AFE_128 (J1.108), U_FE_channel31 (D132.3 R432.1 R832.1)
IN_P32: GEM_AFE_128 (J1.62), U_FE_channel32 (D133.3 R433.1 R833.1)
IN_P33: GEM_AFE_128 (J1.109), U_FE_channel33 (D134.3 R434.1 R834.1)
IN_P34: GEM_AFE_128 (J1.61), U_FE_channel34 (D135.3 R435.1 R835.1)
IN_P35: GEM_AFE_128 (J1.60), U_FE_channel35 (D136.3 R436.1 R836.1)
IN_P36: GEM_AFE_128 (J1.111), U_FE_channel36 (D137.3 R437.1 R837.1)
IN_P37: GEM_AFE_128 (J1.59), U_FE_channel37 (D138.3 R438.1 R838.1)
IN_P38: GEM_AFE_128 (J1.112), U_FE_channel38 (D139.3 R439.1 R839.1)
IN_P39: GEM_AFE_128 (J1.58), U_FE_channel39 (D140.3 R440.1 R840.1)
IN_P40: GEM_AFE_128 (J1.57), U_FE_channel40 (D141.3 R441.1 R841.1)
IN_P41: GEM_AFE_128 (J1.114), U_FE_channel41 (D142.3 R442.1 R842.1)
IN_P42: GEM_AFE_128 (J1.56), U_FE_channel42 (D143.3 R443.1 R843.1)
IN_P43: GEM_AFE_128 (J1.115), U_FE_channel43 (D144.3 R444.1 R844.1)
IN_P44: GEM_AFE_128 (J1.55), U_FE_channel44 (D145.3 R445.1 R845.1)
IN_P45: GEM_AFE_128 (J1.54), U_FE_channel45 (D146.3 R446.1 R846.1)
IN_P46: GEM_AFE_128 (J1.117), U_FE_channel46 (D147.3 R447.1 R847.1)
IN_P47: GEM_AFE_128 (J1.53), U_FE_channel47 (D148.3 R448.1 R848.1)
IN_P48: GEM_AFE_128 (J1.118), U_FE_channel48 (D149.3 R449.1 R849.1)
IN_P49: GEM_AFE_128 (J1.52), U_FE_channel49 (D150.3 R450.1 R850.1)
IN_P50: GEM_AFE_128 (J1.51), U_FE_channel50 (D151.3 R451.1 R851.1)
IN_P51: GEM_AFE_128 (J1.120), U_FE_channel51 (D152.3 R452.1 R852.1)
IN_P52: GEM_AFE_128 (J1.50), U_FE_channel52 (D153.3 R453.1 R853.1)
IN_P53: GEM_AFE_128 (J1.121), U_FE_channel53 (D154.3 R454.1 R854.1)
IN_P54: GEM_AFE_128 (J1.49), U_FE_channel54 (D155.3 R455.1 R855.1)
IN_P55: GEM_AFE_128 (J1.48), U_FE_channel55 (D156.3 R456.1 R856.1)
IN_P56: GEM_AFE_128 (J1.123), U_FE_channel56 (D157.3 R457.1 R857.1)
IN_P57: GEM_AFE_128 (J1.47), U_FE_channel57 (D158.3 R458.1 R858.1)
IN_P58: GEM_AFE_128 (J1.124), U_FE_channel58 (D159.3 R459.1 R859.1)
IN_P59: GEM_AFE_128 (J1.46), U_FE_channel59 (D160.3 R460.1 R860.1)
IN_P60: GEM_AFE_128 (J1.45), U_FE_channel60 (D161.3 R461.1 R861.1)
IN_P61: GEM_AFE_128 (J1.126), U_FE_channel61 (D162.3 R462.1 R862.1)
IN_P62: GEM_AFE_128 (J1.44), U_FE_channel62 (D163.3 R463.1 R863.1)
IN_P63: GEM_AFE_128 (J1.127), U_FE_channel63 (D164.3 R464.1 R864.1)
IN_P64: GEM_AFE_128 (J1.43), U_FE_channel64 (D165.3 R465.1 R865.1)
IN_P65: GEM_AFE_128 (J1.42), U_FE_channel65 (D166.3 R466.1 R866.1)
IN_P66: GEM_AFE_128 (J1.129), U_FE_channel66 (D167.3 R467.1 R867.1)
IN_P67: GEM_AFE_128 (J1.41), U_FE_channel67 (D168.3 R468.1 R868.1)
IN_P68: GEM_AFE_128 (J1.130), U_FE_channel68 (D169.3 R469.1 R869.1)
IN_P69: GEM_AFE_128 (J1.40), U_FE_channel69 (D170.3 R470.1 R870.1)
IN_P70: GEM_AFE_128 (J1.39), U_FE_channel70 (D171.3 R471.1 R871.1)
IN_P71: GEM_AFE_128 (J1.132), U_FE_channel71 (D172.3 R472.1 R872.1)
IN_P72: GEM_AFE_128 (J1.38), U_FE_channel72 (D173.3 R473.1 R873.1)
IN_P73: GEM_AFE_128 (J1.133), U_FE_channel73 (D174.3 R474.1 R874.1)
IN_P74: GEM_AFE_128 (J1.37), U_FE_channel74 (D175.3 R475.1 R875.1)
IN_P75: GEM_AFE_128 (J1.36), U_FE_channel75 (D176.3 R476.1 R876.1)
IN_P76: GEM_AFE_128 (J1.135), U_FE_channel76 (D177.3 R477.1 R877.1)
IN_P77: GEM_AFE_128 (J1.35), U_FE_channel77 (D178.3 R478.1 R878.1)
IN_P78: GEM_AFE_128 (J1.136), U_FE_channel78 (D179.3 R479.1 R879.1)
IN_P79: GEM_AFE_128 (J1.34), U_FE_channel79 (D180.3 R480.1 R880.1)
IN_P80: GEM_AFE_128 (J1.33), U_FE_channel80 (D181.3 R481.1 R881.1)
IN_P81: GEM_AFE_128 (J1.138), U_FE_channel81 (D182.3 R482.1 R882.1)
IN_P82: GEM_AFE_128 (J1.32), U_FE_channel82 (D183.3 R483.1 R883.1)
IN_P83: GEM_AFE_128 (J1.139), U_FE_channel83 (D184.3 R484.1 R884.1)
IN_P84: GEM_AFE_128 (J1.31), U_FE_channel84 (D185.3 R485.1 R885.1)
IN_P85: GEM_AFE_128 (J1.30), U_FE_channel85 (D186.3 R486.1 R886.1)
IN_P86: GEM_AFE_128 (J1.141), U_FE_channel86 (D187.3 R487.1 R887.1)
IN_P87: GEM_AFE_128 (J1.29), U_FE_channel87 (D188.3 R488.1 R888.1)
IN_P88: GEM_AFE_128 (J1.142), U_FE_channel88 (D189.3 R489.1 R889.1)
IN_P89: GEM_AFE_128 (J1.28), U_FE_channel89 (D190.3 R490.1 R890.1)
IN_P90: GEM_AFE_128 (J1.27), U_FE_channel90 (D191.3 R491.1 R891.1)
IN_P91: GEM_AFE_128 (J1.144), U_FE_channel91 (D192.3 R492.1 R892.1)
IN_P92: GEM_AFE_128 (J1.26), U_FE_channel92 (D193.3 R493.1 R893.1)
IN_P93: GEM_AFE_128 (J1.145), U_FE_channel93 (D194.3 R494.1 R894.1)
IN_P94: GEM_AFE_128 (J1.25), U_FE_channel94 (D195.3 R495.1 R895.1)
IN_P95: GEM_AFE_128 (J1.24), U_FE_channel95 (D196.3 R496.1 R896.1)
IN_P96: GEM_AFE_128 (J1.147), U_FE_channel96 (D197.3 R497.1 R897.1)
IN_P97: GEM_AFE_128 (J1.23), U_FE_channel97 (D198.3 R498.1 R898.1)
IN_P98: GEM_AFE_128 (J1.148), U_FE_channel98 (D199.3 R499.1 R899.1)
IN_P99: GEM_AFE_128 (J1.22), U_FE_channel99 (D1100.3 R4100.1 R8100.1)
IN_P100: GEM_AFE_128 (J1.21), U_FE_channel100 (D1101.3 R4101.1 R8101.1)
IN_P101: GEM_AFE_128 (J1.150), U_FE_channel101 (D1102.3 R4102.1 R8102.1)
IN_P102: GEM_AFE_128 (J1.20), U_FE_channel102 (D1103.3 R4103.1 R8103.1)
IN_P103: GEM_AFE_128 (J1.151), U_FE_channel103 (D1104.3 R4104.1 R8104.1)
IN_P104: GEM_AFE_128 (J1.19), U_FE_channel104 (D1105.3 R4105.1 R8105.1)
IN_P105: GEM_AFE_128 (J1.18), U_FE_channel105 (D1106.3 R4106.1 R8106.1)
IN_P106: GEM_AFE_128 (J1.153), U_FE_channel106 (D1107.3 R4107.1 R8107.1)
IN_P107: GEM_AFE_128 (J1.17), U_FE_channel107 (D1108.3 R4108.1 R8108.1)
IN_P108: GEM_AFE_128 (J1.154), U_FE_channel108 (D1109.3 R4109.1 R8109.1)
IN_P109: GEM_AFE_128 (J1.16), U_FE_channel109 (D1110.3 R4110.1 R8110.1)
IN_P110: GEM_AFE_128 (J1.15), U_FE_channel110 (D1111.3 R4111.1 R8111.1)
IN_P111: GEM_AFE_128 (J1.156), U_FE_channel111 (D1112.3 R4112.1 R8112.1)
IN_P112: GEM_AFE_128 (J1.14), U_FE_channel112 (D1113.3 R4113.1 R8113.1)
IN_P113: GEM_AFE_128 (J1.157), U_FE_channel113 (D1114.3 R4114.1 R8114.1)
IN_P114: GEM_AFE_128 (J1.13), U_FE_channel114 (D1115.3 R4115.1 R8115.1)
IN_P115: GEM_AFE_128 (J1.12), U_FE_channel115 (D1116.3 R4116.1 R8116.1)
IN_P116: GEM_AFE_128 (J1.159), U_FE_channel116 (D1117.3 R4117.1 R8117.1)
IN_P117: GEM_AFE_128 (J1.11), U_FE_channel117 (D1118.3 R4118.1 R8118.1)
IN_P118: GEM_AFE_128 (J1.160), U_FE_channel118 (D1119.3 R4119.1 R8119.1)
IN_P119: GEM_AFE_128 (J1.10), U_FE_channel119 (D1120.3 R4120.1 R8120.1)
IN_P120: GEM_AFE_128 (J1.9), U_FE_channel120 (D1121.3 R4121.1 R8121.1)
IN_P121: GEM_AFE_128 (J1.162), U_FE_channel121 (D1122.3 R4122.1 R8122.1)
IN_P122: GEM_AFE_128 (J1.8), U_FE_channel122 (D1123.3 R4123.1 R8123.1)
IN_P123: GEM_AFE_128 (J1.163), U_FE_channel123 (D1124.3 R4124.1 R8124.1)
IN_P124: GEM_AFE_128 (J1.7), U_FE_channel124 (D1125.3 R4125.1 R8125.1)
IN_P125: GEM_AFE_128 (J1.6), U_FE_channel125 (D1126.3 R4126.1 R8126.1)
IN_P126: GEM_AFE_128 (J1.165), U_FE_channel126 (D1127.3 R4127.1 R8127.1)
IN_P127: GEM_AFE_128 (J1.5), U_FE_channel127 (D1128.3 R4128.1 R8128.1)
OFFSET0: U_FE_channel0 (C4A.2 IC1A.4), DAC (IC3.1)
OFFSET1: U_FE_channel1 (C4B.2 IC1B.4), DAC (IC3.28)
OFFSET2: U_FE_channel2 (C4C.2 IC1C.4), DAC (IC3.27)
OFFSET3: U_FE_channel3 (C4D.2 IC1D.4), DAC (IC3.26)
OFFSET4: U_FE_channel4 (C4E.2 IC1E.4), DAC (IC3.10)
OFFSET5: U_FE_channel5 (C4F.2 IC1F.4), DAC (IC3.9)
OFFSET6: U_FE_channel6 (C4G.2 IC1G.4), DAC (IC3.8)
OFFSET7: U_FE_channel7 (C4H.2 IC1H.4), DAC (IC3.7)
OFFSET8: U_FE_channel8 (C4I.2 IC1I.4), DAC (IC3.25)
OFFSET9: U_FE_channel9 (C4J.2 IC1J.4), DAC (IC3.24)
OFFSET10: U_FE_channel10 (C4K.2 IC1K.4), DAC (IC3.23)
OFFSET11: U_FE_channel11 (C4L.2 IC1L.4), DAC (IC3.22)
OFFSET12: U_FE_channel12 (C4M.2 IC1M.4), DAC (IC3.14)
OFFSET13: U_FE_channel13 (C4N.2 IC1N.4), DAC (IC3.13)
OFFSET14: U_FE_channel14 (C4O.2 IC1O.4), DAC (IC3.12)
OFFSET15: U_FE_channel15 (C4P.2 IC1P.4), DAC (IC3.11)
OFFSET16: U_FE_channel16 (C4Q.2 IC1Q.4), DAC (IC4.1)
OFFSET17: U_FE_channel17 (C4R.2 IC1R.4), DAC (IC4.28)
OFFSET18: U_FE_channel18 (C4S.2 IC1S.4), DAC (IC4.27)
OFFSET19: U_FE_channel19 (C4T.2 IC1T.4), DAC (IC4.26)
OFFSET20: U_FE_channel20 (C4U.2 IC1U.4), DAC (IC4.10)
OFFSET21: U_FE_channel21 (C4V.2 IC1V.4), DAC (IC4.9)
OFFSET22: U_FE_channel22 (C4W.2 IC1W.4), DAC (IC4.8)
OFFSET23: U_FE_channel23 (C4X.2 IC1X.4), DAC (IC4.7)
OFFSET24: U_FE_channel24 (C4Y.2 IC1Y.4), DAC (IC4.25)
OFFSET25: U_FE_channel25 (C4Z.2 IC1Z.4), DAC (IC4.24)
OFFSET26: U_FE_channel26 (C427.2 IC127.4), DAC (IC4.23)
OFFSET27: U_FE_channel27 (C428.2 IC128.4), DAC (IC4.22)
OFFSET28: U_FE_channel28 (C429.2 IC129.4), DAC (IC4.14)
OFFSET29: U_FE_channel29 (C430.2 IC130.4), DAC (IC4.13)
OFFSET30: U_FE_channel30 (C431.2 IC131.4), DAC (IC4.12)
OFFSET31: U_FE_channel31 (C432.2 IC132.4), DAC (IC4.11)
OFFSET32: U_FE_channel32 (C433.2 IC133.4), DAC (IC5.1)
OFFSET33: U_FE_channel33 (C434.2 IC134.4), DAC (IC5.28)
OFFSET34: U_FE_channel34 (C435.2 IC135.4), DAC (IC5.27)
OFFSET35: U_FE_channel35 (C436.2 IC136.4), DAC (IC5.26)
OFFSET36: U_FE_channel36 (C437.2 IC137.4), DAC (IC5.10)
OFFSET37: U_FE_channel37 (C438.2 IC138.4), DAC (IC5.9)
OFFSET38: U_FE_channel38 (C439.2 IC139.4), DAC (IC5.8)
OFFSET39: U_FE_channel39 (C440.2 IC140.4), DAC (IC5.7)
OFFSET40: U_FE_channel40 (C441.2 IC141.4), DAC (IC5.25)
OFFSET41: U_FE_channel41 (C442.2 IC142.4), DAC (IC5.24)
OFFSET42: U_FE_channel42 (C443.2 IC143.4), DAC (IC5.23)
OFFSET43: U_FE_channel43 (C444.2 IC144.4), DAC (IC5.22)
OFFSET44: U_FE_channel44 (C445.2 IC145.4), DAC (IC5.14)
OFFSET45: U_FE_channel45 (C446.2 IC146.4), DAC (IC5.13)
OFFSET46: U_FE_channel46 (C447.2 IC147.4), DAC (IC5.12)
OFFSET47: U_FE_channel47 (C448.2 IC148.4), DAC (IC5.11)
OFFSET48: U_FE_channel48 (C449.2 IC149.4), DAC (IC6.1)
OFFSET49: U_FE_channel49 (C450.2 IC150.4), DAC (IC6.28)
OFFSET50: U_FE_channel50 (C451.2 IC151.4), DAC (IC6.27)
OFFSET51: U_FE_channel51 (C452.2 IC152.4), DAC (IC6.26)
OFFSET52: U_FE_channel52 (C453.2 IC153.4), DAC (IC6.10)
OFFSET53: U_FE_channel53 (C454.2 IC154.4), DAC (IC6.9)
OFFSET54: U_FE_channel54 (C455.2 IC155.4), DAC (IC6.8)
OFFSET55: U_FE_channel55 (C456.2 IC156.4), DAC (IC6.7)
OFFSET56: U_FE_channel56 (C457.2 IC157.4), DAC (IC6.25)
OFFSET57: U_FE_channel57 (C458.2 IC158.4), DAC (IC6.24)
OFFSET58: U_FE_channel58 (C459.2 IC159.4), DAC (IC6.23)
OFFSET59: U_FE_channel59 (C460.2 IC160.4), DAC (IC6.22)
OFFSET60: U_FE_channel60 (C461.2 IC161.4), DAC (IC6.14)
OFFSET61: U_FE_channel61 (C462.2 IC162.4), DAC (IC6.13)
OFFSET62: U_FE_channel62 (C463.2 IC163.4), DAC (IC6.12)
OFFSET63: U_FE_channel63 (C464.2 IC164.4), DAC (IC6.11)
OFFSET64: U_FE_channel64 (C465.2 IC165.4), DAC (IC7.1)
OFFSET65: U_FE_channel65 (C466.2 IC166.4), DAC (IC7.28)
OFFSET66: U_FE_channel66 (C467.2 IC167.4), DAC (IC7.27)
OFFSET67: U_FE_channel67 (C468.2 IC168.4), DAC (IC7.26)
OFFSET68: U_FE_channel68 (C469.2 IC169.4), DAC (IC7.10)
OFFSET69: U_FE_channel69 (C470.2 IC170.4), DAC (IC7.9)
OFFSET70: U_FE_channel70 (C471.2 IC171.4), DAC (IC7.8)
OFFSET71: U_FE_channel71 (C472.2 IC172.4), DAC (IC7.7)
OFFSET72: U_FE_channel72 (C473.2 IC173.4), DAC (IC7.25)
OFFSET73: U_FE_channel73 (C474.2 IC174.4), DAC (IC7.24)
OFFSET74: U_FE_channel74 (C475.2 IC175.4), DAC (IC7.23)
OFFSET75: U_FE_channel75 (C476.2 IC176.4), DAC (IC7.22)
OFFSET76: U_FE_channel76 (C477.2 IC177.4), DAC (IC7.14)
OFFSET77: U_FE_channel77 (C478.2 IC178.4), DAC (IC7.13)
OFFSET78: U_FE_channel78 (C479.2 IC179.4), DAC (IC7.12)
OFFSET79: U_FE_channel79 (C480.2 IC180.4), DAC (IC7.11)
OFFSET80: U_FE_channel80 (C481.2 IC181.4), DAC (IC8.1)
OFFSET81: U_FE_channel81 (C482.2 IC182.4), DAC (IC8.28)
OFFSET82: U_FE_channel82 (C483.2 IC183.4), DAC (IC8.27)
OFFSET83: U_FE_channel83 (C484.2 IC184.4), DAC (IC8.26)
OFFSET84: U_FE_channel84 (C485.2 IC185.4), DAC (IC8.10)
OFFSET85: U_FE_channel85 (C486.2 IC186.4), DAC (IC8.9)
OFFSET86: U_FE_channel86 (C487.2 IC187.4), DAC (IC8.8)
OFFSET87: U_FE_channel87 (C488.2 IC188.4), DAC (IC8.7)
OFFSET88: U_FE_channel88 (C489.2 IC189.4), DAC (IC8.25)
OFFSET89: U_FE_channel89 (C490.2 IC190.4), DAC (IC8.24)
OFFSET90: U_FE_channel90 (C491.2 IC191.4), DAC (IC8.23)
OFFSET91: U_FE_channel91 (C492.2 IC192.4), DAC (IC8.22)
OFFSET92: U_FE_channel92 (C493.2 IC193.4), DAC (IC8.14)
OFFSET93: U_FE_channel93 (C494.2 IC194.4), DAC (IC8.13)
OFFSET94: U_FE_channel94 (C495.2 IC195.4), DAC (IC8.12)
OFFSET95: U_FE_channel95 (C496.2 IC196.4), DAC (IC8.11)
OFFSET96: U_FE_channel96 (C497.2 IC197.4), DAC (IC10.1)
OFFSET97: U_FE_channel97 (C498.2 IC198.4), DAC (IC10.28)
OFFSET98: U_FE_channel98 (C499.2 IC199.4), DAC (IC10.27)
OFFSET99: U_FE_channel99 (C4100.2 IC1100.4), DAC (IC10.26)
OFFSET100: U_FE_channel100 (C4101.2 IC1101.4), DAC (IC10.10)
OFFSET101: U_FE_channel101 (C4102.2 IC1102.4), DAC (IC10.9)
OFFSET102: U_FE_channel102 (C4103.2 IC1103.4), DAC (IC10.8)
OFFSET103: U_FE_channel103 (C4104.2 IC1104.4), DAC (IC10.7)
OFFSET104: U_FE_channel104 (C4105.2 IC1105.4), DAC (IC10.25)
OFFSET105: U_FE_channel105 (C4106.2 IC1106.4), DAC (IC10.24)
OFFSET106: U_FE_channel106 (C4107.2 IC1107.4), DAC (IC10.23)
OFFSET107: U_FE_channel107 (C4108.2 IC1108.4), DAC (IC10.22)
OFFSET108: U_FE_channel108 (C4109.2 IC1109.4), DAC (IC10.14)
OFFSET109: U_FE_channel109 (C4110.2 IC1110.4), DAC (IC10.13)
OFFSET110: U_FE_channel110 (C4111.2 IC1111.4), DAC (IC10.12)
OFFSET111: U_FE_channel111 (C4112.2 IC1112.4), DAC (IC10.11)
OFFSET112: U_FE_channel112 (C4113.2 IC1113.4), DAC (IC11.1)
OFFSET113: U_FE_channel113 (C4114.2 IC1114.4), DAC (IC11.28)
OFFSET114: U_FE_channel114 (C4115.2 IC1115.4), DAC (IC11.27)
OFFSET115: U_FE_channel115 (C4116.2 IC1116.4), DAC (IC11.26)
OFFSET116: U_FE_channel116 (C4117.2 IC1117.4), DAC (IC11.10)
OFFSET117: U_FE_channel117 (C4118.2 IC1118.4), DAC (IC11.9)
OFFSET118: U_FE_channel118 (C4119.2 IC1119.4), DAC (IC11.8)
OFFSET119: U_FE_channel119 (C4120.2 IC1120.4), DAC (IC11.7)
OFFSET120: U_FE_channel120 (C4121.2 IC1121.4), DAC (IC11.25)
OFFSET121: U_FE_channel121 (C4122.2 IC1122.4), DAC (IC11.24)
OFFSET122: U_FE_channel122 (C4123.2 IC1123.4), DAC (IC11.23)
OFFSET123: U_FE_channel123 (C4124.2 IC1124.4), DAC (IC11.22)
OFFSET124: U_FE_channel124 (C4125.2 IC1125.4), DAC (IC11.14)
OFFSET125: U_FE_channel125 (C4126.2 IC1126.4), DAC (IC11.13)
OFFSET126: U_FE_channel126 (C4127.2 IC1127.4), DAC (IC11.12)
OFFSET127: U_FE_channel127 (C4128.2 IC1128.4), DAC (IC11.11)
OUTP0: GEM_AFE_128 (J2.1), U_FE_channel0 (R6A.2)
OUTP1: GEM_AFE_128 (J2.2), U_FE_channel1 (R6B.2)
OUTP2: GEM_AFE_128 (J2.3), U_FE_channel2 (R6C.2)
OUTP3: GEM_AFE_128 (J2.4), U_FE_channel3 (R6D.2)
OUTP4: GEM_AFE_128 (J2.5), U_FE_channel4 (R6E.2)
OUTP5: GEM_AFE_128 (J2.6), U_FE_channel5 (R6F.2)
OUTP6: GEM_AFE_128 (J2.7), U_FE_channel6 (R6G.2)
OUTP7: GEM_AFE_128 (J2.8), U_FE_channel7 (R6H.2)
OUTP8: GEM_AFE_128 (J2.9), U_FE_channel8 (R6I.2)
OUTP9: GEM_AFE_128 (J2.10), U_FE_channel9 (R6J.2)
OUTP10: GEM_AFE_128 (J2.11), U_FE_channel10 (R6K.2)
OUTP11: GEM_AFE_128 (J2.12), U_FE_channel11 (R6L.2)
OUTP12: GEM_AFE_128 (J2.13), U_FE_channel12 (R6M.2)
OUTP13: GEM_AFE_128 (J2.14), U_FE_channel13 (R6N.2)
OUTP14: GEM_AFE_128 (J2.15), U_FE_channel14 (R6O.2)
OUTP15: GEM_AFE_128 (J2.16), U_FE_channel15 (R6P.2)
OUTP16: GEM_AFE_128 (J2.17), U_FE_channel16 (R6Q.2)
OUTP17: GEM_AFE_128 (J2.18), U_FE_channel17 (R6R.2)
OUTP18: GEM_AFE_128 (J2.19), U_FE_channel18 (R6S.2)
OUTP19: GEM_AFE_128 (J2.20), U_FE_channel19 (R6T.2)
OUTP20: GEM_AFE_128 (J2.21), U_FE_channel20 (R6U.2)
OUTP21: GEM_AFE_128 (J2.22), U_FE_channel21 (R6V.2)
OUTP22: GEM_AFE_128 (J2.23), U_FE_channel22 (R6W.2)
OUTP23: GEM_AFE_128 (J2.24), U_FE_channel23 (R6X.2)
OUTP24: GEM_AFE_128 (J2.25), U_FE_channel24 (R6Y.2)
OUTP25: GEM_AFE_128 (J2.26), U_FE_channel25 (R6Z.2)
OUTP26: GEM_AFE_128 (J2.27), U_FE_channel26 (R627.2)
OUTP27: GEM_AFE_128 (J2.28), U_FE_channel27 (R628.2)
OUTP28: GEM_AFE_128 (J2.29), U_FE_channel28 (R629.2)
OUTP29: GEM_AFE_128 (J2.30), U_FE_channel29 (R630.2)
OUTP30: GEM_AFE_128 (J2.31), U_FE_channel30 (R631.2)
OUTP31: GEM_AFE_128 (J2.32), U_FE_channel31 (R632.2)
OUTP32: GEM_AFE_128 (J2.48), U_FE_channel32 (R633.2)
OUTP33: GEM_AFE_128 (J2.49), U_FE_channel33 (R634.2)
OUTP34: GEM_AFE_128 (J2.50), U_FE_channel34 (R635.2)
OUTP35: GEM_AFE_128 (J2.51), U_FE_channel35 (R636.2)
OUTP36: GEM_AFE_128 (J2.52), U_FE_channel36 (R637.2)
OUTP37: GEM_AFE_128 (J2.53), U_FE_channel37 (R638.2)
OUTP38: GEM_AFE_128 (J2.54), U_FE_channel38 (R639.2)
OUTP39: GEM_AFE_128 (J2.55), U_FE_channel39 (R640.2)
OUTP40: GEM_AFE_128 (J2.56), U_FE_channel40 (R641.2)
OUTP41: GEM_AFE_128 (J2.57), U_FE_channel41 (R642.2)
OUTP42: GEM_AFE_128 (J2.58), U_FE_channel42 (R643.2)
OUTP43: GEM_AFE_128 (J2.59), U_FE_channel43 (R644.2)
OUTP44: GEM_AFE_128 (J2.60), U_FE_channel44 (R645.2)
OUTP45: GEM_AFE_128 (J2.61), U_FE_channel45 (R646.2)
OUTP46: GEM_AFE_128 (J2.62), U_FE_channel46 (R647.2)
OUTP47: GEM_AFE_128 (J2.63), U_FE_channel47 (R648.2)
OUTP48: GEM_AFE_128 (J2.64), U_FE_channel48 (R649.2)
OUTP49: GEM_AFE_128 (J2.65), U_FE_channel49 (R650.2)
OUTP50: GEM_AFE_128 (J2.66), U_FE_channel50 (R651.2)
OUTP51: GEM_AFE_128 (J2.67), U_FE_channel51 (R652.2)
OUTP52: GEM_AFE_128 (J2.68), U_FE_channel52 (R653.2)
OUTP53: GEM_AFE_128 (J2.69), U_FE_channel53 (R654.2)
OUTP54: GEM_AFE_128 (J2.70), U_FE_channel54 (R655.2)
OUTP55: GEM_AFE_128 (J2.71), U_FE_channel55 (R656.2)
OUTP56: GEM_AFE_128 (J2.72), U_FE_channel56 (R657.2)
OUTP57: GEM_AFE_128 (J2.73), U_FE_channel57 (R658.2)
OUTP58: GEM_AFE_128 (J2.74), U_FE_channel58 (R659.2)
OUTP59: GEM_AFE_128 (J2.75), U_FE_channel59 (R660.2)
OUTP60: GEM_AFE_128 (J2.76), U_FE_channel60 (R661.2)
OUTP61: GEM_AFE_128 (J2.77), U_FE_channel61 (R662.2)
OUTP62: GEM_AFE_128 (J2.78), U_FE_channel62 (R663.2)
OUTP63: GEM_AFE_128 (J2.79), U_FE_channel63 (R664.2)
OUTP64: GEM_AFE_128 (J2.100), U_FE_channel64 (R665.2)
OUTP65: GEM_AFE_128 (J2.101), U_FE_channel65 (R666.2)
OUTP66: GEM_AFE_128 (J2.102), U_FE_channel66 (R667.2)
OUTP67: GEM_AFE_128 (J2.103), U_FE_channel67 (R668.2)
OUTP68: GEM_AFE_128 (J2.104), U_FE_channel68 (R669.2)
OUTP69: GEM_AFE_128 (J2.105), U_FE_channel69 (R670.2)
OUTP70: GEM_AFE_128 (J2.106), U_FE_channel70 (R671.2)
OUTP71: GEM_AFE_128 (J2.107), U_FE_channel71 (R672.2)
OUTP72: GEM_AFE_128 (J2.108), U_FE_channel72 (R673.2)
OUTP73: GEM_AFE_128 (J2.109), U_FE_channel73 (R674.2)
OUTP74: GEM_AFE_128 (J2.110), U_FE_channel74 (R675.2)
OUTP75: GEM_AFE_128 (J2.111), U_FE_channel75 (R676.2)
OUTP76: GEM_AFE_128 (J2.112), U_FE_channel76 (R677.2)
OUTP77: GEM_AFE_128 (J2.113), U_FE_channel77 (R678.2)
OUTP78: GEM_AFE_128 (J2.114), U_FE_channel78 (R679.2)
OUTP79: GEM_AFE_128 (J2.115), U_FE_channel79 (R680.2)
OUTP80: GEM_AFE_128 (J2.116), U_FE_channel80 (R681.2)
OUTP81: GEM_AFE_128 (J2.117), U_FE_channel81 (R682.2)
OUTP82: GEM_AFE_128 (J2.118), U_FE_channel82 (R683.2)
OUTP83: GEM_AFE_128 (J2.119), U_FE_channel83 (R684.2)
OUTP84: GEM_AFE_128 (J2.120), U_FE_channel84 (R685.2)
OUTP85: GEM_AFE_128 (J2.121), U_FE_channel85 (R686.2)
OUTP86: GEM_AFE_128 (J2.122), U_FE_channel86 (R687.2)
OUTP87: GEM_AFE_128 (J2.123), U_FE_channel87 (R688.2)
OUTP88: GEM_AFE_128 (J2.124), U_FE_channel88 (R689.2)
OUTP89: GEM_AFE_128 (J2.125), U_FE_channel89 (R690.2)
OUTP90: GEM_AFE_128 (J2.126), U_FE_channel90 (R691.2)
OUTP91: GEM_AFE_128 (J2.127), U_FE_channel91 (R692.2)
OUTP92: GEM_AFE_128 (J2.128), U_FE_channel92 (R693.2)
OUTP93: GEM_AFE_128 (J2.129), U_FE_channel93 (R694.2)
OUTP94: GEM_AFE_128 (J2.130), U_FE_channel94 (R695.2)
OUTP95: GEM_AFE_128 (J2.131), U_FE_channel95 (R696.2)
OUTP96: GEM_AFE_128 (J2.149), U_FE_channel96 (R697.2)
OUTP97: GEM_AFE_128 (J2.150), U_FE_channel97 (R698.2)
OUTP98: GEM_AFE_128 (J2.151), U_FE_channel98 (R699.2)
OUTP99: GEM_AFE_128 (J2.152), U_FE_channel99 (R6100.2)
OUTP100: GEM_AFE_128 (J2.153), U_FE_channel100 (R6101.2)
OUTP101: GEM_AFE_128 (J2.154), U_FE_channel101 (R6102.2)
OUTP102: GEM_AFE_128 (J2.155), U_FE_channel102 (R6103.2)
OUTP103: GEM_AFE_128 (J2.156), U_FE_channel103 (R6104.2)
OUTP104: GEM_AFE_128 (J2.157), U_FE_channel104 (R6105.2)
OUTP105: GEM_AFE_128 (J2.158), U_FE_channel105 (R6106.2)
OUTP106: GEM_AFE_128 (J2.159), U_FE_channel106 (R6107.2)
OUTP107: GEM_AFE_128 (J2.160), U_FE_channel107 (R6108.2)
OUTP108: GEM_AFE_128 (J2.161), U_FE_channel108 (R6109.2)
OUTP109: GEM_AFE_128 (J2.162), U_FE_channel109 (R6110.2)
OUTP110: GEM_AFE_128 (J2.163), U_FE_channel110 (R6111.2)
OUTP111: GEM_AFE_128 (J2.164), U_FE_channel111 (R6112.2)
OUTP112: GEM_AFE_128 (J2.165), U_FE_channel112 (R6113.2)
OUTP113: GEM_AFE_128 (J2.166), U_FE_channel113 (R6114.2)
OUTP114: GEM_AFE_128 (J2.167), U_FE_channel114 (R6115.2)
OUTP115: GEM_AFE_128 (J2.168), U_FE_channel115 (R6116.2)
OUTP116: GEM_AFE_128 (J2.169), U_FE_channel116 (R6117.2)
OUTP117: GEM_AFE_128 (J2.170), U_FE_channel117 (R6118.2)
OUTP118: GEM_AFE_128 (J2.171), U_FE_channel118 (R6119.2)
OUTP119: GEM_AFE_128 (J2.172), U_FE_channel119 (R6120.2)
OUTP120: GEM_AFE_128 (J2.173), U_FE_channel120 (R6121.2)
OUTP121: GEM_AFE_128 (J2.174), U_FE_channel121 (R6122.2)
OUTP122: GEM_AFE_128 (J2.175), U_FE_channel122 (R6123.2)
OUTP123: GEM_AFE_128 (J2.176), U_FE_channel123 (R6124.2)
OUTP124: GEM_AFE_128 (J2.177), U_FE_channel124 (R6125.2)
OUTP125: GEM_AFE_128 (J2.178), U_FE_channel125 (R6126.2)
OUTP126: GEM_AFE_128 (J2.179), U_FE_channel126 (R6127.2)
OUTP127: GEM_AFE_128 (J2.180), U_FE_channel127 (R6128.2)
RCLK: GEM_AFE_128 (R26.2), CAL_logics (16 pins)
SCL: GEM_AFE_128 (IC31.2 IC32.2 J2.45), GEM_AFE128_Supply (7 pins)
SDA: GEM_AFE_128 (IC31.1 IC32.1 J2.44), GEM_AFE128_Supply (7 pins)
VREF_A: DAC (C19.2 C20.2 IC3.21 IC4.21), GEM_AFE128_Supply (U1.1 U1.2)
VREF_B: DAC (C29.2 C30.2 IC5.21 IC6.21), GEM_AFE128_Supply (U1.6 U1.7)
VREF_C: DAC (C39.2 C40.2 IC7.21 IC8.21), GEM_AFE128_Supply (U2.1 U2.2)
VREF_D: DAC (C50.2 C51.2 IC10.21 IC11.21), GEM_AFE128_Supply (U2.6 U2.7)

## Assembly variants
Standard: not fitted C92 C93 C94 IC30 IC34 IC38 IC39 R19 R20 R21 R22 R23 R24 R31